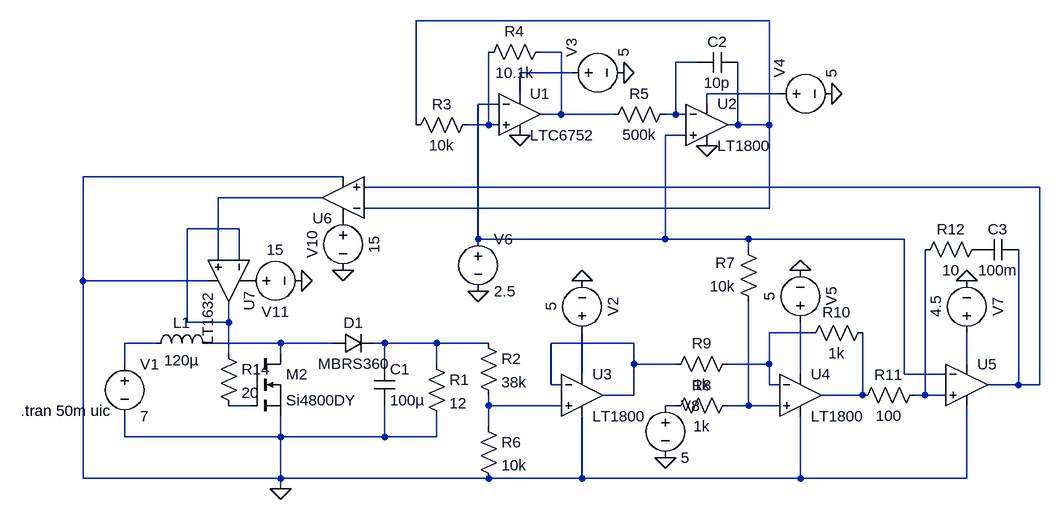
[diagram p0: schematic lab7oc.asc]
lab7oc.asc, the LTspice schematic file:
Version 4.1
SHEET 1 1976 680
WIRE 960 -528 416 -528
WIRE 640 -480 608 -480
WIRE 848 -464 816 -464
WIRE 656 -448 576 -448
WIRE 576 -416 576 -448
WIRE 976 -416 864 -416
WIRE 544 -400 512 -400
WIRE 864 -400 864 -416
WIRE 640 -384 640 -480
WIRE 640 -384 608 -384
WIRE 720 -384 640 -384
WIRE 816 -384 816 -464
WIRE 816 -384 800 -384
WIRE 832 -384 816 -384
WIRE 416 -368 416 -528
WIRE 528 -368 528 -480
WIRE 528 -368 496 -368
WIRE 544 -368 528 -368
WIRE 912 -368 912 -464
WIRE 912 -368 896 -368
WIRE 960 -368 960 -528
WIRE 960 -368 912 -368
WIRE 832 -352 800 -352
WIRE 304 -288 -96 -288
WIRE 1376 -272 336 -272
WIRE 272 -256 112 -256
WIRE 960 -240 960 -368
WIRE 960 -240 336 -240
WIRE 144 -208 64 -208
WIRE 512 -192 512 -400
WIRE 800 -192 800 -352
WIRE 800 -192 512 -192
WIRE 928 -192 800 -192
WIRE 1168 -192 928 -192
WIRE 928 -176 928 -192
WIRE 112 -160 112 -256
WIRE 144 -160 144 -208
WIRE -96 -128 -96 -288
WIRE 96 -128 -96 -128
WIRE 64 -64 64 -208
WIRE 128 -64 128 -96
WIRE 128 -64 64 -64
WIRE 1024 -48 960 -48
WIRE 16 -32 -32 -32
WIRE 208 -32 96 -32
WIRE 288 -32 208 -32
WIRE 368 -32 352 -32
WIRE 448 -32 368 -32
WIRE 528 -32 448 -32
WIRE 752 -32 624 -32
WIRE 128 -16 128 -64
WIRE 208 -16 208 -32
WIRE -32 0 -32 -32
WIRE 368 0 368 -32
WIRE 448 0 448 -32
WIRE 752 0 752 -32
WIRE 816 0 752 0
WIRE 960 0 960 -48
WIRE 960 0 896 0
WIRE 1264 0 1264 -48
WIRE 672 16 672 -48
WIRE 1008 16 1008 -64
WIRE 1168 16 1168 -192
WIRE 1232 16 1168 16
WIRE 624 32 624 -32
WIRE 640 32 624 32
WIRE 960 32 960 0
WIRE 976 32 960 32
WIRE 1344 32 1344 -176
WIRE 1344 32 1296 32
WIRE 1376 32 1376 -272
WIRE 1376 32 1344 32
WIRE 752 48 752 0
WIRE 752 48 704 48
WIRE 1104 48 1104 -48
WIRE 1104 48 1040 48
WIRE 1200 48 1200 -176
WIRE 1200 48 1184 48
WIRE 1232 48 1200 48
WIRE 160 64 128 64
WIRE 528 64 528 48
WIRE 640 64 528 64
WIRE 816 64 800 64
WIRE 928 64 928 -96
WIRE 928 64 896 64
WIRE 976 64 928 64
WIRE 528 96 528 64
WIRE -32 112 -32 80
WIRE 208 112 208 80
WIRE 208 112 -32 112
WIRE 368 112 368 64
WIRE 368 112 208 112
WIRE 448 112 448 80
WIRE 448 112 368 112
WIRE -96 176 -96 -128
WIRE 208 176 208 112
WIRE 208 176 -96 176
WIRE 528 176 208 176
WIRE 672 176 672 80
WIRE 672 176 528 176
WIRE 1008 176 1008 80
WIRE 1008 176 672 176
WIRE 1264 176 1264 64
WIRE 1264 176 1008 176
WIRE 208 192 208 176
FLAG 576 -352 0
FLAG 736 -448 0
FLAG 864 -336 0
FLAG 1056 -416 0
FLAG 672 -128 0
FLAG 1008 -144 0
FLAG 1264 -128 0
FLAG 800 144 0
FLAG 304 -144 0
FLAG 208 192 0
FLAG 240 -128 0
FLAG 512 -112 0
SYMBOL voltage -32 -16 R0
WINDOW 123 0 0 Left 0
WINDOW 39 0 0 Left 0
SYMATTR InstName V1
SYMATTR Value 7
SYMBOL diode 288 -16 R270
WINDOW 0 32 32 VTop 2
WINDOW 3 0 32 VBottom 2
SYMATTR InstName D1
SYMATTR Value MBRS360
SYMBOL ind 0 -16 R270
WINDOW 0 32 56 VTop 2
WINDOW 3 5 56 VBottom 2
SYMATTR InstName L1
SYMATTR Value 120µ
SYMATTR SpiceLine Rser=1m
SYMBOL cap 352 0 R0
SYMATTR InstName C1
SYMATTR Value 100µ
SYMBOL res 432 -16 R0
SYMATTR InstName R1
SYMATTR Value 12
SYMBOL Comparators\\LTC6752 576 -448 R0
SYMATTR InstName U1
SYMBOL OpAmps\\LT1800 864 -432 R0
SYMATTR InstName U2
SYMBOL res 512 -384 R90
WINDOW 0 0 56 VBottom 2
WINDOW 3 32 56 VTop 2
SYMATTR InstName R3
SYMATTR Value 10k
SYMBOL res 624 -496 R90
WINDOW 0 0 56 VBottom 2
WINDOW 3 32 56 VTop 2
SYMATTR InstName R4
SYMATTR Value 10.1k
SYMBOL res 816 -400 R90
WINDOW 0 0 56 VBottom 2
WINDOW 3 32 56 VTop 2
SYMATTR InstName R5
SYMATTR Value 500k
SYMBOL cap 912 -480 R90
WINDOW 0 0 32 VBottom 2
WINDOW 3 32 32 VTop 2
SYMATTR InstName C2
SYMATTR Value 10p
SYMBOL voltage 640 -448 R270
WINDOW 123 0 0 Left 0
WINDOW 39 0 0 Left 0
SYMATTR InstName V3
SYMATTR Value 5
SYMBOL voltage 960 -416 R270
WINDOW 123 0 0 Left 0
WINDOW 39 0 0 Left 0
SYMATTR InstName V4
SYMATTR Value 5
SYMBOL nmos 160 -16 R0
SYMATTR InstName M2
SYMATTR Value Si4800DY
SYMBOL res 512 -48 R0
SYMATTR InstName R2
SYMATTR Value 38k
SYMBOL res 512 80 R0
SYMATTR InstName R6
SYMATTR Value 10k
SYMBOL OpAmps\\LT1800 672 -16 R0
SYMATTR InstName U3
SYMBOL voltage 672 -32 R180
WINDOW 0 -32 56 VBottom 2
WINDOW 3 32 56 VTop 2
WINDOW 123 0 0 Left 0
WINDOW 39 0 0 Left 0
SYMATTR InstName V2
SYMATTR Value 5
SYMBOL OpAmps\\LT1800 1008 -16 R0
SYMATTR InstName U4
SYMBOL voltage 1008 -48 R180
WINDOW 0 -32 56 VBottom 2
WINDOW 3 32 56 VTop 2
WINDOW 123 0 0 Left 0
WINDOW 39 0 0 Left 0
SYMATTR InstName V5
SYMATTR Value 5
SYMBOL res 944 -80 R180
WINDOW 0 36 76 Left 2
WINDOW 3 36 40 Left 2
SYMATTR InstName R7
SYMATTR Value 10k
SYMBOL res 912 48 R90
WINDOW 0 0 56 VBottom 2
WINDOW 3 32 56 VTop 2
SYMATTR InstName R8
SYMATTR Value 1k
SYMBOL res 912 -16 R90
WINDOW 0 0 56 VBottom 2
WINDOW 3 32 56 VTop 2
SYMATTR InstName R9
SYMATTR Value 1k
SYMBOL res 1120 -64 R90
WINDOW 0 0 56 VBottom 2
WINDOW 3 32 56 VTop 2
SYMATTR InstName R10
SYMATTR Value 1k
SYMBOL res 1200 32 R90
WINDOW 0 0 56 VBottom 2
WINDOW 3 32 56 VTop 2
SYMATTR InstName R11
SYMATTR Value 100
SYMBOL res 1296 -192 R90
WINDOW 0 0 56 VBottom 2
WINDOW 3 32 56 VTop 2
SYMATTR InstName R12
SYMATTR Value 10
SYMBOL voltage 1264 -32 R180
WINDOW 0 -32 56 VBottom 2
WINDOW 3 32 56 VTop 2
WINDOW 123 0 0 Left 0
WINDOW 39 0 0 Left 0
SYMATTR InstName V7
SYMATTR Value 4.5
SYMBOL voltage 800 48 R0
WINDOW 123 0 0 Left 0
WINDOW 39 0 0 Left 0
SYMATTR InstName V8
SYMATTR Value 5
SYMBOL OpAmps\\UniversalOpAmp2 304 -256 R180
SYMATTR InstName U6
SYMBOL voltage 304 -240 R0
WINDOW 0 -32 56 VBottom 2
WINDOW 3 32 56 VTop 2
WINDOW 123 0 0 Left 0
WINDOW 39 0 0 Left 0
SYMATTR InstName V10
SYMATTR Value 15
SYMBOL OpAmps\\LT1632 192 -128 R90
SYMATTR InstName U7
SYMBOL voltage 144 -128 R270
WINDOW 0 -32 56 VBottom 2
WINDOW 3 32 56 VTop 2
WINDOW 123 0 0 Left 0
WINDOW 39 0 0 Left 0
SYMATTR InstName V11
SYMATTR Value 15
SYMBOL res 112 -32 R0
SYMATTR InstName R14
SYMATTR Value 20
SYMBOL voltage 512 -208 R0
WINDOW 123 0 0 Left 0
WINDOW 39 0 0 Left 0
SYMATTR InstName V6
SYMATTR Value 2.5
SYMBOL OpAmps\\UniversalOpAmp2 1264 32 R0
SYMATTR InstName U5
SYMBOL cap 1344 -192 R90
WINDOW 0 0 32 VBottom 2
WINDOW 3 32 32 VTop 2
SYMATTR InstName C3
SYMATTR Value 100m
TEXT -192 72 Left 2 !.tran 50m uic

The netlist it stands for:
* lab7oc.asc
V1 N012 0 7
D1 N013 N014 MBRS360
L1 N012 N013 120µ Rser=1m
C1 N014 0 100µ
R1 N014 0 12
X§U1 N007 N006 N004 0 N002 LTC6752  ; pins In+ In- V+ V- OUT
X§U2 N006 N003 N005 0 N001 LT1800  ; pins In+ In- V+ V- OUT
R3 N007 N001 10k
R4 N002 N007 10.1k
R5 N003 N002 500k
C2 N001 N003 10p
V3 N004 0 5
V4 N005 0 5
M2 N013 N021 0 0 Si4800DY
R2 N014 N022 38k
R6 N022 0 10k
X§U3 N022 N015 N017 0 N015 LT1800  ; pins In+ In- V+ V- OUT
V2 N017 0 5
X§U4 N024 N011 N018 0 N019 LT1800  ; pins In+ In- V+ V- OUT
V5 N018 0 5
R7 N024 N006 10k
R8 N024 N023 1k
R9 N011 N015 1k
R10 N019 N011 1k
R11 N020 N019 100
R12 P001 N020 10
V7 N016 0 4.5
V8 N023 0 5
X§U6 N008 N001 P002 0 N009 level2 Avol=1Meg GBW=10Meg Slew=10Meg Ilimit=25m Rail=0 Vos=0 En=0 Enk=0 In=0 Ink=0 Rin=500Meg  ; pins In+ In- V+ V- OUT
V10 P002 0 15
X§U7 N009 N010 P003 0 N010 LT1632  ; pins In+ In- V+ V- OUT
V11 P003 0 15
R14 N010 N021 20
V6 N006 0 2.5
X§U5 N020 N006 N016 0 N008 level2 Avol=1Meg GBW=10Meg Slew=10Meg Ilimit=25m Rail=0 Vos=0 En=0 Enk=0 In=0 Ink=0 Rin=500Meg  ; pins In+ In- V+ V- OUT
C3 N008 P001 100m
.model D D
.lib standard.dio
.model NMOS NMOS
.model PMOS PMOS
.lib standard.mos
.tran 50m uic
.lib LTC7.lib
.lib UniversalOpAmp2.lib
.lib LTC.lib
.backanno
.end